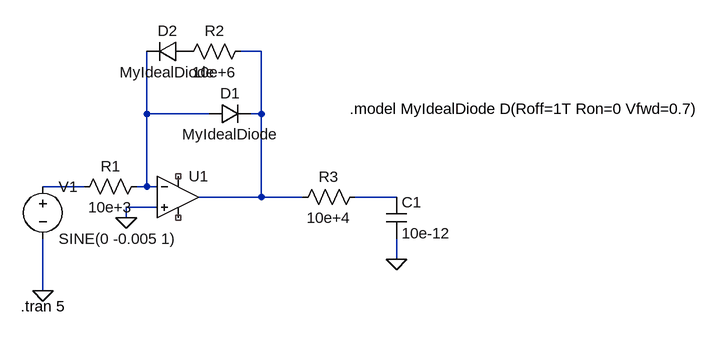
[diagram p0: schematic single_halfwave_rectifier_amplifier.asc]
single_halfwave_rectifier_amplifier.asc, the LTspice schematic file:
Version 4
SHEET 1 892 680
WIRE 160 48 128 48
WIRE -16 144 -16 48
WIRE 80 144 -16 144
WIRE 160 144 160 48
WIRE 160 144 144 144
WIRE -112 256 -176 256
WIRE -16 256 -16 144
WIRE -16 256 -32 256
WIRE 0 256 -16 256
WIRE 160 272 160 144
WIRE 160 272 64 272
WIRE 224 272 160 272
WIRE 368 272 304 272
WIRE 0 288 -48 288
WIRE -48 304 -48 288
WIRE 368 368 368 336
WIRE -176 416 -176 336
FLAG -48 304 0
FLAG -176 416 0
FLAG 368 368 0
SYMBOL OpAmps\\UniversalOpAmp 32 272 R0
SYMATTR InstName U1
SYMBOL voltage -176 240 R0
WINDOW 123 0 0 Left 0
WINDOW 39 0 0 Left 0
SYMATTR InstName V1
SYMATTR Value SINE(0 -0.005 1)
SYMBOL res -16 240 R90
WINDOW 0 0 56 VBottom 2
WINDOW 3 32 56 VTop 2
SYMATTR InstName R1
SYMATTR Value 10e+3
SYMBOL diode 80 160 R270
WINDOW 0 32 32 VTop 2
WINDOW 3 0 32 VBottom 2
SYMATTR InstName D1
SYMATTR Value MyIdealDiode
SYMBOL diode 48 32 R90
WINDOW 0 0 32 VBottom 2
WINDOW 3 32 32 VTop 2
SYMATTR InstName D2
SYMATTR Value MyIdealDiode
SYMBOL res 144 32 R90
WINDOW 0 0 56 VBottom 2
WINDOW 3 32 56 VTop 2
SYMATTR InstName R2
SYMATTR Value 10e+6
SYMBOL res 320 256 R90
WINDOW 0 0 56 VBottom 2
WINDOW 3 32 56 VTop 2
SYMATTR InstName R3
SYMATTR Value 10e+4
SYMBOL cap 352 272 R0
SYMATTR InstName C1
SYMATTR Value 10e-12
TEXT -210 440 Left 2 !.tran 5
TEXT 296 136 Left 2 !.model MyIdealDiode D(Roff=1T Ron=0 Vfwd=0.7)

The netlist it stands for:
* single_halfwave_rectifier_amplifier.asc
XU1 0 N002 NC_01 NC_02 N001 level1 Avol=1Meg GBW=10Meg Vos=0 En=0 Enk=0 In=0 Ink=0 Rin=500Meg  ; pins In+ In- V+ V- OUT
V1 N003 0 SINE(0 -0.005 1)
R1 N002 N003 10e+3
D1 N002 N001 MyIdealDiode
D2 P001 N002 MyIdealDiode
R2 N001 P001 10e+6
R3 N004 N001 10e+4
C1 N004 0 10e-12
.model D D
.lib standard.dio
.tran 5
.model MyIdealDiode D(Roff=1T Ron=0 Vfwd=0.7)
.lib UniversalOpAmp1.lib
.backanno
.end